# EAGLE schematic STM32F765VIT EAGLE (EAGLE 7.5.0)
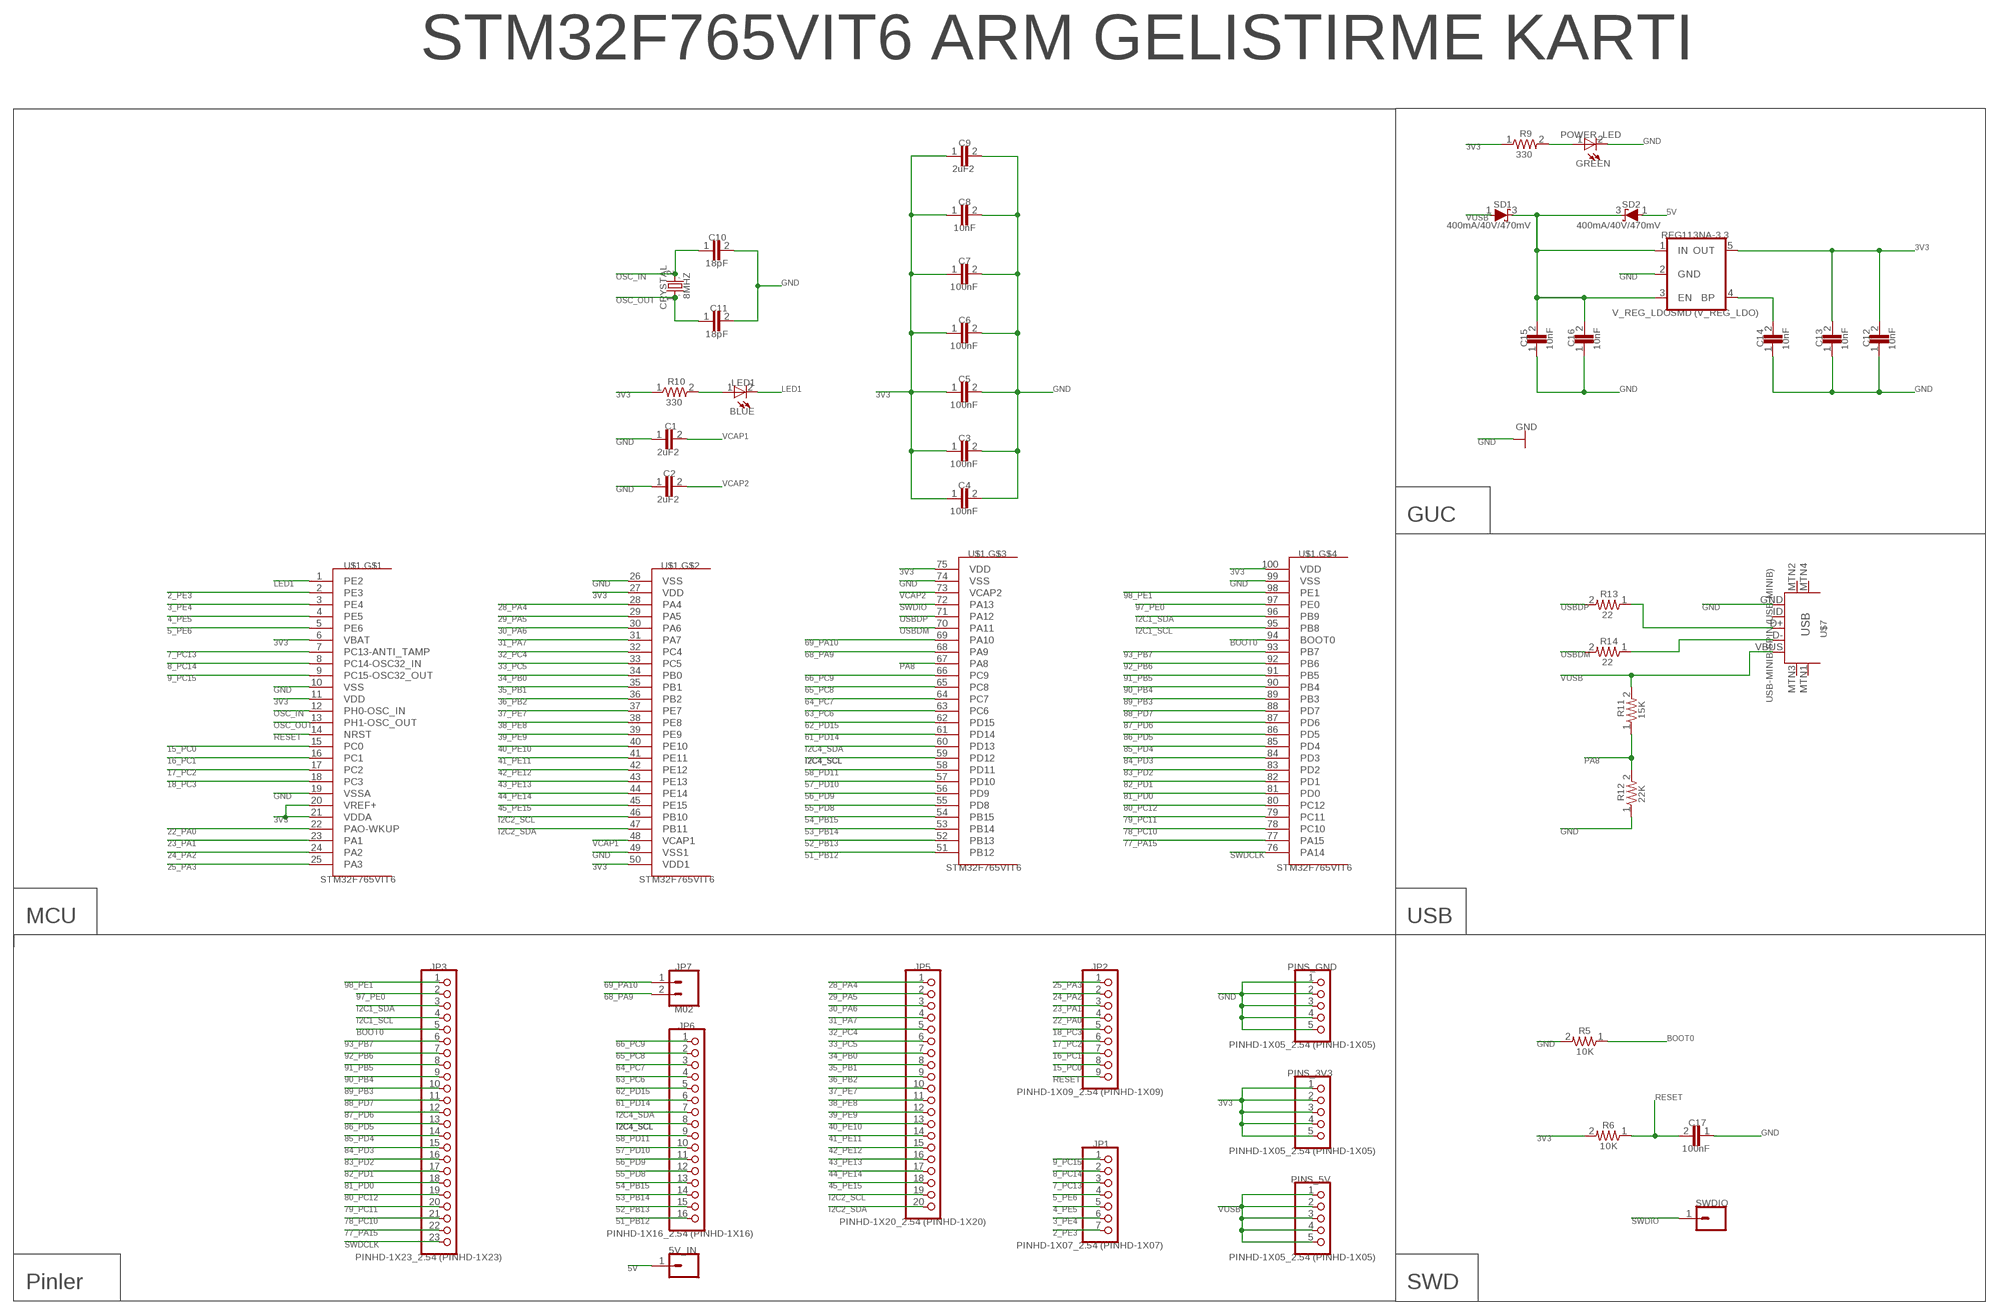
[diagram p0: schematic, sheet 1]

## Parts
5V_IN  M01PTH_LONGPAD_(M01)  [1X01_LONGPAD]
C1  2uF2  CAP1206_(CAP)  [1206]
C2  2uF2  CAP1206_(CAP)  [1206]
C3  100nF  CAP1206_(CAP)  [1206]
C4  100nF  CAP1206_(CAP)  [1206]
C5  100nF  CAP1206_(CAP)  [1206]
C6  100nF  CAP1206_(CAP)  [1206]
C7  100nF  CAP1206_(CAP)  [1206]
C8  10nF  CAP1206_(CAP)  [1206]
C9  2uF2  CAP1206_(CAP)  [1206]
C10  18pF  CAP1206_(CAP)  [1206]
C11  18pF  CAP1206_(CAP)  [1206]
C12  10nF  CAP1206_(CAP)  [1206]
C13  10nF  CAP1206_(CAP)  [1206]
C14  10nF  CAP1206_(CAP)  [1206]
C15  10nF  CAP1206_(CAP)  [1206]
C16  10nF  CAP1206_(CAP)  [1206]
C17  100nF  CAP1206_(CAP)  [1206]
CRYSTAL  8MHZ  CSM-7X-DU  [CSM-7X-DU]
JP1  PINHD-1X07_2.54_(PINHD-1X07)  [1X07]
JP2  PINHD-1X09_2.54_(PINHD-1X09)  [1X09]
JP3  PINHD-1X23_2.54_(PINHD-1X23)  [1X23]
JP5  PINHD-1X20_2.54_(PINHD-1X20)  [1X20]
JP6  PINHD-1X16_2.54_(PINHD-1X16)  [1X16]
JP7  M02  [1X02_LONGPADS]
LED1  BLUE  LED1206_(LED)  [1206_2]
PINS_3V3  PINHD-1X05_2.54_(PINHD-1X05)  [1X05]
PINS_5V  PINHD-1X05_2.54_(PINHD-1X05)  [1X05]
PINS_GND  PINHD-1X05_2.54_(PINHD-1X05)  [1X05]
POWER_LED  GREEN  LED1206_(LED)  [1206_2]
R5  10K  RESISTOR1206_(RESISTOR)  [1206]
R6  10K  RESISTOR1206_(RESISTOR)  [1206]
R9  330  RESISTOR1206_(RESISTOR)  [1206]
R10  330  RESISTOR1206_(RESISTOR)  [1206]
R11  15K  RESISTOR1206_(RESISTOR)  [1206]
R12  22K  RESISTOR1206_(RESISTOR)  [1206]
R13  22  RESISTOR1206_(RESISTOR)  [1206]
R14  22  RESISTOR1206_(RESISTOR)  [1206]
REG113NA-3.3  V_REG_LDOSMD_(V_REG_LDO)  [SOT23-5]
SD1  400mA/40V/470mV  DIODE-SCHOTTKY-ZLLS500_(DIODE-SCHOTTKY)  [SOT23-3]
SD2  400mA/40V/470mV  DIODE-SCHOTTKY-ZLLS500_(DIODE-SCHOTTKY)  [SOT23-3]
SWDIO  M01PTH_LONGPAD_(M01)  [1X01_LONGPAD]
U$1  STM32F765VIT6  [LQFP100]
U$7  USB-MINIB-5PIN_(USB-MINIB)  [USB-MINIB]

## Nets
2_PE3: JP1.7 U$1.2(PART_G$1:PE3)
3_PE4: JP1.6 U$1.3(PART_G$1:PE4)
3V3: C3.1 C4.1 C5.1 C6.1 C7.1 C8.1 C9.1 C12.2 C13.2 PINS_3V3.1 PINS_3V3.2 PINS_3V3.3 PINS_3V3.4 PINS_3V3.5 R6.2 R9.1 R10.1 REG113NA-3.3.5(OUT) U$1.6(PART_G$1:VBAT) U$1.11(PART_G$1:VDD) U$1.20(PART_G$1:VREF+) U$1.21(PART_G$1:VDDA) U$1.27(PART_G$2:VDD) U$1.50(PART_G$2:VDD1) U$1.75(PART_G$3:VDD) U$1.100(PART_G$4:VDD)
4_PE5: JP1.5 U$1.4(PART_G$1:PE5)
5_PE6: JP1.4 U$1.5(PART_G$1:PE6)
5V: 5V_IN.1 SD2.1(A)
7_PC13: JP1.3 U$1.7(PART_G$1:PC13-ANTI_TAMP)
8_PC14: JP1.2 U$1.8(PART_G$1:PC14-OSC32_IN)
9_PC15: JP1.1 U$1.9(PART_G$1:PC15-OSC32_OUT)
15_PC0: JP2.8 U$1.15(PART_G$1:PC0)
16_PC1: JP2.7 U$1.16(PART_G$1:PC1)
17_PC2: JP2.6 U$1.17(PART_G$1:PC2)
18_PC3: JP2.5 U$1.18(PART_G$1:PC3)
22_PA0: JP2.4 U$1.22(PART_G$1:PAO-WKUP)
23_PA1: JP2.3 U$1.23(PART_G$1:PA1)
24_PA2: JP2.2 U$1.24(PART_G$1:PA2)
25_PA3: JP2.1 U$1.25(PART_G$1:PA3)
28_PA4: JP5.1 U$1.28(PART_G$2:PA4)
29_PA5: JP5.2 U$1.29(PART_G$2:PA5)
30_PA6: JP5.3 U$1.30(PART_G$2:PA6)
31_PA7: JP5.4 U$1.31(PART_G$2:PA7)
32_PC4: JP5.5 U$1.32(PART_G$2:PC4)
33_PC5: JP5.6 U$1.33(PART_G$2:PC5)
34_PB0: JP5.7 U$1.34(PART_G$2:PB0)
35_PB1: JP5.8 U$1.35(PART_G$2:PB1)
36_PB2: JP5.9 U$1.36(PART_G$2:PB2)
37_PE7: JP5.10 U$1.37(PART_G$2:PE7)
38_PE8: JP5.11 U$1.38(PART_G$2:PE8)
39_PE9: JP5.12 U$1.39(PART_G$2:PE9)
40_PE10: JP5.13 U$1.40(PART_G$2:PE10)
41_PE11: JP5.14 U$1.41(PART_G$2:PE11)
42_PE12: JP5.15 U$1.42(PART_G$2:PE12)
43_PE13: JP5.16 U$1.43(PART_G$2:PE13)
44_PE14: JP5.17 U$1.44(PART_G$2:PE14)
45_PE15: JP5.18 U$1.45(PART_G$2:PE15)
51_PB12: JP6.16 U$1.51(PART_G$3:PB12)
52_PB13: JP6.15 U$1.52(PART_G$3:PB13)
53_PB14: JP6.14 U$1.53(PART_G$3:PB14)
54_PB15: JP6.13 U$1.54(PART_G$3:PB15)
55_PD8: JP6.12 U$1.55(PART_G$3:PD8)
56_PD9: JP6.11 U$1.56(PART_G$3:PD9)
57_PD10: JP6.10 U$1.57(PART_G$3:PD10)
58_PD11: JP6.9 U$1.58(PART_G$3:PD11)
61_PD14: JP6.6 U$1.61(PART_G$3:PD14)
62_PD15: JP6.5 U$1.62(PART_G$3:PD15)
63_PC6: JP6.4 U$1.63(PART_G$3:PC6)
64_PC7: JP6.3 U$1.64(PART_G$3:PC7)
65_PC8: JP6.2 U$1.65(PART_G$3:PC8)
66_PC9: JP6.1 U$1.66(PART_G$3:PC9)
68_PA9: JP7.2 U$1.68(PART_G$3:PA9)
69_PA10: JP7.1 U$1.69(PART_G$3:PA10)
77_PA15: JP3.22 U$1.77(PART_G$4:PA15)
78_PC10: JP3.21 U$1.78(PART_G$4:PC10)
79_PC11: JP3.20 U$1.79(PART_G$4:PC11)
80_PC12: JP3.19 U$1.80(PART_G$4:PC12)
81_PD0: JP3.18 U$1.81(PART_G$4:PD0)
82_PD1: JP3.17 U$1.82(PART_G$4:PD1)
83_PD2: JP3.16 U$1.83(PART_G$4:PD2)
84_PD3: JP3.15 U$1.84(PART_G$4:PD3)
85_PD4: JP3.14 U$1.85(PART_G$4:PD4)
86_PD5: JP3.13 U$1.86(PART_G$4:PD5)
87_PD6: JP3.12 U$1.87(PART_G$4:PD6)
88_PD7: JP3.11 U$1.88(PART_G$4:PD7)
89_PB3: JP3.10 U$1.89(PART_G$4:PB3)
90_PB4: JP3.9 U$1.90(PART_G$4:PB4)
91_PB5: JP3.8 U$1.91(PART_G$4:PB5)
92_PB6: JP3.7 U$1.92(PART_G$4:PB6)
93_PB7: JP3.6 U$1.93(PART_G$4:PB7)
97_PE0: JP3.2 U$1.97(PART_G$4:PE0)
98_PE1: JP3.1 U$1.98(PART_G$4:PE1)
BOOT0: JP3.5 R5.1 U$1.94(PART_G$4:BOOT0)
GND: C1.1 C2.1 C3.2 C4.2 C5.2 C6.2 C7.2 C8.2 C9.2 C10.2 C11.2 C12.1 C13.1 C14.1 C15.1 C16.1 C17.1 PINS_GND.1 PINS_GND.2 PINS_GND.3 PINS_GND.4 PINS_GND.5 POWER_LED.2(C) R5.2 R12.1 REG113NA-3.3.2(GND) U$1.10(PART_G$1:VSS) U$1.19(PART_G$1:VSSA) U$1.26(PART_G$2:VSS) U$1.49(PART_G$2:VSS1) U$1.74(PART_G$3:VSS) U$1.99(PART_G$4:VSS) U$7.GND
I2C1_SCL: JP3.4 U$1.95(PART_G$4:PB8)
I2C1_SDA: JP3.3 U$1.96(PART_G$4:PB9)
I2C2_SCL: JP5.19 U$1.46(PART_G$2:PB10)
I2C2_SDA: JP5.20 U$1.47(PART_G$2:PB11)
I2C4_SCL: JP6.8 U$1.59(PART_G$3:PD12)
I2C4_SDA: JP6.7 U$1.60(PART_G$3:PD13)
LED1: LED1.2(C) U$1.1(PART_G$1:PE2)
N$1: POWER_LED.1(A) R9.2
N$2: LED1.1(A) R10.2
N$3: C15.2 C16.2 REG113NA-3.3.1(IN) REG113NA-3.3.3(EN) SD1.3(C) SD2.3(C)
N$5: R14.1 U$7.D-
N$6: R13.1 U$7.D+
NR: C14.2 REG113NA-3.3.4(BP)
OSC_IN: C10.1 CRYSTAL.2 U$1.12(PART_G$1:PH0-OSC_IN)
OSC_OUT: C11.1 CRYSTAL.1 U$1.13(PART_G$1:PH1-OSC_OUT)
PA8: R11.1 R12.2 U$1.67(PART_G$3:PA8)
RESET: C17.2 JP2.9 R6.1 U$1.14(PART_G$1:NRST)
SWDCLK: JP3.23 U$1.76(PART_G$4:PA14)
SWDIO: SWDIO.1 U$1.72(PART_G$3:PA13)
USBDM: R14.2 U$1.70(PART_G$3:PA11)
USBDP: R13.2 U$1.71(PART_G$3:PA12)
VCAP1: C1.2 U$1.48(PART_G$2:VCAP1)
VCAP2: C2.2 U$1.73(PART_G$3:VCAP2)
VUSB: PINS_5V.1 PINS_5V.2 PINS_5V.3 PINS_5V.4 PINS_5V.5 R11.2 SD1.1(A) U$7.VBUS
Unconnected: U$7.ID U$7.MTN1(MTN2) U$7.MTN2(MTN3) U$7.MTN3(MTN1) U$7.MTN4

## Notes on the sheet
- STM32F765VIT6 ARM GELISTIRME KARTI
- R9 | POWER_LED
- 3V3 | GND
- C9
- 330
- GREEN
- 2uF2
- C8 | SD1 | SD2
- VUSB | 5V
- 10nF | 400mA/40V/470mV | 400mA/40V/470mV
- C10 | REG113NA-3.3
- 3V3
- 18pF
- C7
- OSC_IN | GND
- 2
- 100nF
- GND
- 1
- OSC_OUT | 8MHZ
- CRYSTAL | C11 | V_REG_LDOSMD (V_REG_LDO)
- C6
- 18pF
- 100nF
- C15 | C16 | C14 | C13 | C12
- 10nF | 10nF | 10nF | 10nF | 10nF
- R10 | C5
- LED1
- 3V3 | LED1 | 3V3 | GND | GND | GND
- 330 | 100nF
- BLUE
- C1 | GND
- GND | VCAP1 | GND
- C3
- 2uF2
- 100nF
- C2
- GND | VCAP2
- C4
- 2uF2
- 100nF
- GUC
- U$1.G$3 | U$1.G$4
- U$1.G$1 | U$1.G$2 | 3V3 | 3V3
- LED1 | GND | GND | GND
- 2_PE3 | 3V3 | VCAP2 | 98_PE1
- R13
- 3_PE4 | 28_PA4 | SWDIO | 97_PE0 | USBDP | GND
- 22 | USB
- 4_PE5 | 29_PA5 | USBDP | I2C1_SDA
- 5_PE6 | 30_PA6 | USBDM | I2C1_SCL
- U$7
- 3V3 | 31_PA7 | 69_PA10 | BOOT0
- R14
- 7_PC13 | 32_PC4 | 68_PA9 | 93_PB7 | USBDM
- 22
- 8_PC14 | 33_PC5 | PA8 | 92_PB6
- 9_PC15 | 34_PB0 | 66_PC9 | 91_PB5 | VUSB
- GND | 35_PB1 | 65_PC8 | 90_PB4
- 3V3 | 36_PB2 | 64_PC7 | 89_PB3
- USB-MINIB-5PIN (USB-MINIB)
- OSC_IN | 37_PE7 | 63_PC6 | 88_PD7
- R11 | 15K
- OSC_OUT | 38_PE8 | 62_PD15 | 87_PD6
- RESET | 39_PE9 | 61_PD14 | 86_PD5
- 15_PC0 | 40_PE10 | I2C4_SDA | 85_PD4
- 16_PC1 | 41_PE11 | I2C4_SCL | I2C4_SCL | 84_PD3 | PA8
- 17_PC2 | 42_PE12 | 58_PD11 | 83_PD2
- 18_PC3 | 43_PE13 | 57_PD10 | 82_PD1
- GND | 44_PE14 | 56_PD9 | 81_PD0
- R12 | 22K
- 45_PE15 | 55_PD8 | 80_PC12
- 3V3 | I2C2_SCL | 54_PB15 | 79_PC11
- 22_PA0 | I2C2_SDA | 53_PB14 | 78_PC10 | GND
- 23_PA1 | VCAP1 | 52_PB13 | 77_PA15
- 24_PA2 | GND | 51_PB12 | SWDCLK
- 25_PA3 | 3V3 | STM32F765VIT6 | STM32F765VIT6
- STM32F765VIT6 | STM32F765VIT6
- MCU | USB
- JP3 | JP7 | JP5 | JP2 | PINS_GND
- 98_PE1 | 69_PA10 | 28_PA4 | 25_PA3
- 97_PE0 | 68_PA9 | 29_PA5 | 24_PA2 | GND
- I2C1_SDA | M02 | 30_PA6 | 23_PA1
- I2C1_SCL | 31_PA7 | 22_PA0
- BOOT0 | JP6 | 32_PC4 | 18_PC3
- R5
- 93_PB7 | 66_PC9 | 33_PC5 | 17_PC2 | PINHD-1X05_2.54 (PINHD-1X05) | GND | BOOT0
- 10K
- 92_PB6 | 65_PC8 | 34_PB0 | 16_PC1
- 91_PB5 | 64_PC7 | 35_PB1 | 15_PC0
- 90_PB4 | 63_PC6 | 36_PB2 | RESET | PINS_3V3
- 89_PB3 | 62_PD15 | 37_PE7 | PINHD-1X09_2.54 (PINHD-1X09)
- 88_PD7 | 61_PD14 | 38_PE8 | 3V3 | RESET
- 87_PD6 | I2C4_SDA | 39_PE9
- 86_PD5 | I2C4_SCL | I2C4_SCL | 40_PE10
- R6 | C17
- 85_PD4 | 58_PD11 | 41_PE11 | 3V3 | GND
- 10K | 100nF
- 84_PD3 | 57_PD10 | 42_PE12 | JP1 | PINHD-1X05_2.54 (PINHD-1X05)
- 83_PD2 | 56_PD9 | 43_PE13 | 9_PC15
- 82_PD1 | 55_PD8 | 44_PE14 | 8_PC14
- 81_PD0 | 54_PB15 | 45_PE15 | 7_PC13 | PINS_5V
- 80_PC12 | 53_PB14 | I2C2_SCL | 5_PE6
- 79_PC11 | 52_PB13 | I2C2_SDA | 4_PE5 | VUSB | SWDIO
- 78_PC10 | 51_PB12 | PINHD-1X20_2.54 (PINHD-1X20) | 3_PE4 | SWDIO
- 77_PA15 | PINHD-1X16_2.54 (PINHD-1X16) | 2_PE3
- SWDCLK | PINHD-1X07_2.54 (PINHD-1X07)
- PINHD-1X23_2.54 (PINHD-1X23) | 5V_IN | PINHD-1X05_2.54 (PINHD-1X05)
- 5V
- Pinler | SWD

## Library data of the parts
5V_IN SWDIO = common:M01PTH_LONGPAD_(M01)
C1 C2 C9 = common:CAP1206_(CAP)
C3-C8 C10-C17 = common:CAP1206_(CAP); VALUE: 2uF2
CRYSTAL = common:CSM-7X-DU; OC_FARNELL: unknown; OC_NEWARK: unknown
JP1 = common:PINHD-1X07_2.54_(PINHD-1X07)
JP2 = common:PINHD-1X09_2.54_(PINHD-1X09)
JP3 = common:PINHD-1X23_2.54_(PINHD-1X23)
JP5 = common:PINHD-1X20_2.54_(PINHD-1X20)
JP6 = common:PINHD-1X16_2.54_(PINHD-1X16)
JP7 = common:M02
LED1 = common:LED1206_(LED); VALUE: GREEN
PINS_3V3 PINS_5V PINS_GND = common:PINHD-1X05_2.54_(PINHD-1X05)
POWER_LED = common:LED1206_(LED)
R5 R6 R11-R14 = common:RESISTOR1206_(RESISTOR); VALUE: 330
R9 R10 = common:RESISTOR1206_(RESISTOR)
REG113NA-3.3 = common:V_REG_LDOSMD_(V_REG_LDO)
SD1 SD2 = common:DIODE-SCHOTTKY-ZLLS500_(DIODE-SCHOTTKY); PROD_ID: DIO-08411
U$1 = common:STM32F765VIT6
U$7 = common:USB-MINIB-5PIN_(USB-MINIB)